# Altium schematic sheet driver.SchDoc
size A4; SheetNumber: 3; SheetTotal: 3; SPICEModelCacheZVOPVZIA: <root> / <DocumentId>ZVOPVZIA</DocumentId> / <CacheFrame Number="0"> / <Model Name="nmos" Kind="MDL"> / <Text>*Default N-Channel MOSFET / *Pinout: D,G,S / .MODEL NMOS NMOS()</Text> / </Model> / <Model Name="2n3904" Kind="MDL"> / <Text>*2N3904 / *Si 310mW  40V 200mA 300MHz pkg:TO-92B 1,2,3 / .MODEL 2N3904 NPN(IS=1.4E-14 BF=300 VAF=100 IKF=0.025 ISE=3E-13 / + BR=7.5 RC=2.4 CJE=4.5E-12 TF=4E-10 CJC=3.5E-12 TR=2.1E-8 XTB=1.5 KF=9E-16 )</Text> / </Model> / <Model Name="cap" Kind="MDL"> / <Text>*Default semiconductor capacitor / .MODEL CAP C()</Text> / </Model> / </CacheFrame> / </root>
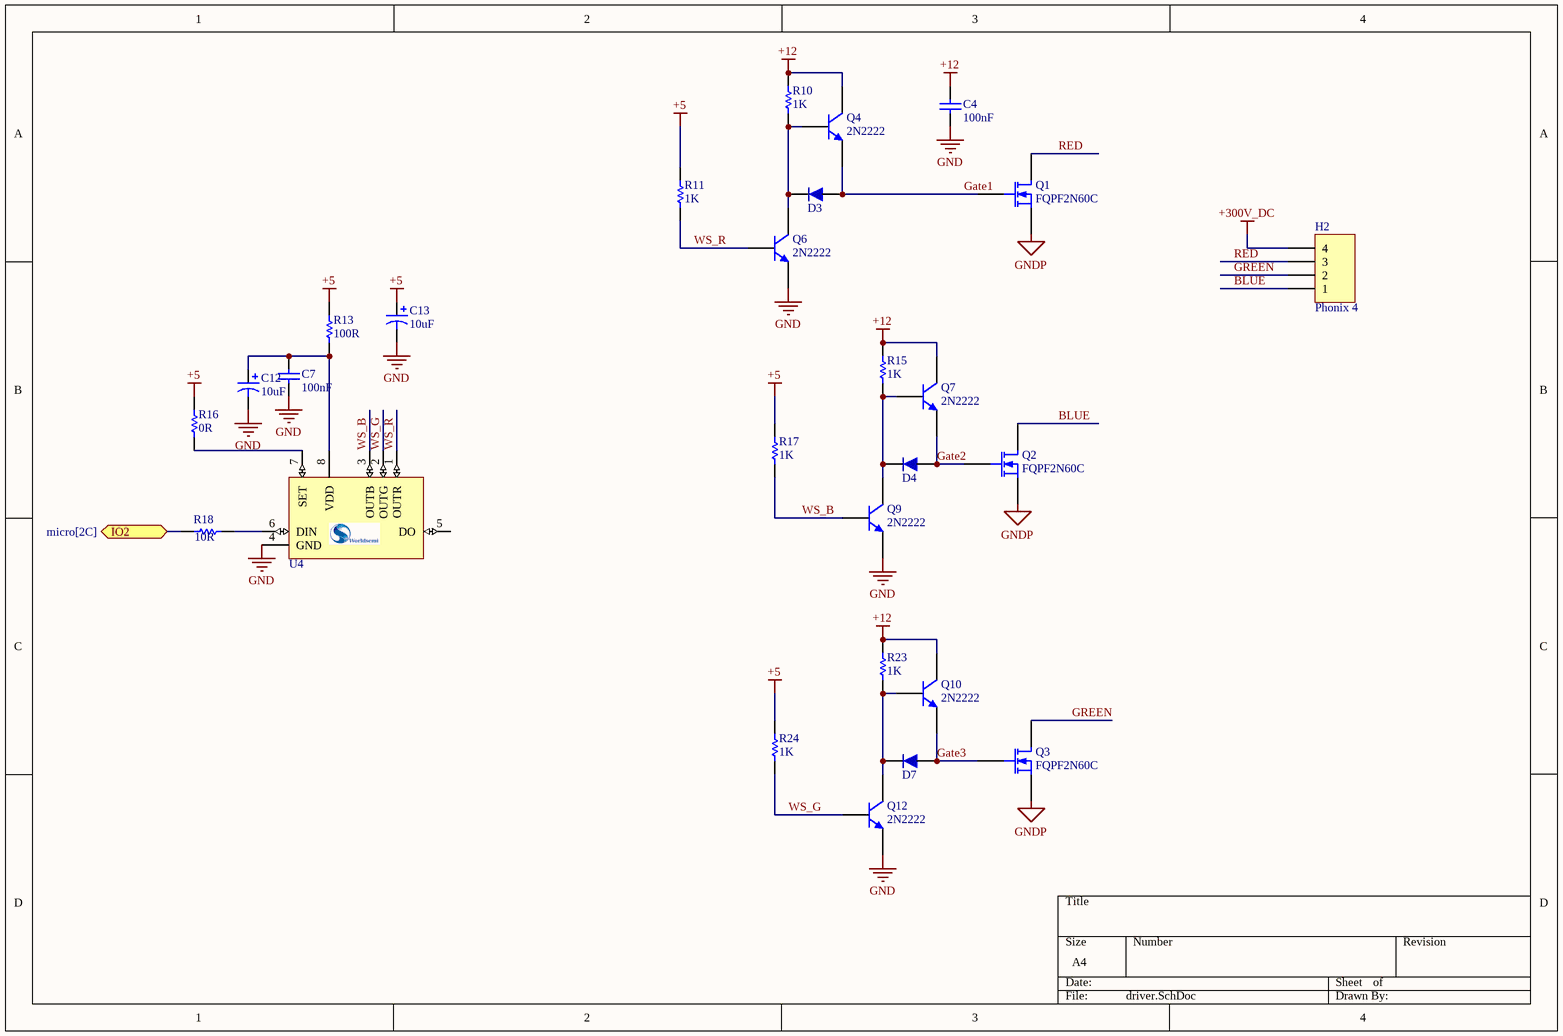
[diagram p0: driver.SchDoc]

## Parts
C4  value 100nF  [CAP0805]  (hidden comment: cap 100nF)
C7  value 100nF  [CAP0805]  (hidden comment: cap 100nF)
C12  value 10uF  [CAP0805]  (hidden comment: cap 10uF)
C13  value 10uF  [CAP0805]  (hidden comment: cap 10uF)
D3  1n5822  [DIOM4629X24N]  (value not drawn)
D4  1n5822  [DIOM4629X24N]  (value not drawn)
D7  1n5822  [DIOM4629X24N]  (value not drawn)
H2  Phonix 4  [phoenix terminal R 4]
Q1  FQPF2N60C  [TO-220]
Q2  FQPF2N60C  [TO-220]
Q3  FQPF2N60C  [TO-220]
Q4  2N2222  [SOT23_BEC_L]
Q6  2N2222  [SOT23_BEC_L]
Q7  2N2222  [SOT23_BEC_L]
Q9  2N2222  [SOT23_BEC_L]
Q10  2N2222  [SOT23_BEC_L]
Q12  2N2222  [SOT23_BEC_L]
R10  value 1K  [RES0805]  (hidden comment: Res 1K)
R11  value 1K  [RES0805]  (hidden comment: Res 1K)
R13  value 100R  [RES0805]  (hidden comment: Res 100R)
R15  value 1K  [RES0805]  (hidden comment: Res 1K)
R16  value 0R  [RES0805]  (hidden comment: Res 0R)
R17  value 1K  [RES0805]  (hidden comment: Res 1K)
R18  value 10R  [RES0805]  (hidden comment: Res 10R)
R23  value 1K  [RES0805]  (hidden comment: Res 1K)
R24  value 1K  [RES0805]  (hidden comment: Res 1K)
U4  WS2811 SMD  [8S2_N]  (value not drawn)

## Ports
IO2 (bidir, see micro[2C])

## Nets
+5: C13.1 R11.1 R13.2 R16.2 R17.1 R24.1
+12: C4.1 Q4.3(C) Q7.3(C) Q10.3(C) R10.2 R15.2 R23.2
+300V_DC: H2.4
GND: C4.2 C7.2 C12.2 C13.2 Q6.1(E) Q9.1(E) Q12.1(E) U4.4(GND)
GNDP: Q1.3(S) Q2.3(S) Q3.3(S)
BLUE: H2.1 Q2.1(D)
Gate1: D3.1 Q1.2(G) Q4.1(E)
Gate2: D4.1 Q2.2(G) Q7.1(E)
Gate3: D7.1 Q3.2(G) Q10.1(E)
GREEN: H2.2 Q3.1(D)
IO2: R18.1 ; port IO2
RED: H2.3 Q1.1(D)
WS_B: Q9.2(B) R17.2 U4.3(OUTB)
WS_G: Q12.2(B) R24.2 U4.2(OUTG)
WS_R: Q6.2(B) R11.2 U4.1(OUTR)
NetC7_1: C7.1 C12.1 R13.1 U4.8(VDD)
NetD3_2: D3.2 Q4.2(B) Q6.3(C) R10.1
NetD4_2: D4.2 Q7.2(B) Q9.3(C) R15.1
NetD7_2: D7.2 Q10.2(B) Q12.3(C) R23.1
NetR16_1: R16.1 U4.7(SET)
NetR18_2: R18.2 U4.6(DIN)

Not connected (* = marked no-connect by the designer): U4 5(DO)

## Library data of the parts
C4 C7 = Cap ceramic: CAP seramic
C12 C13 = Cap Pol1: CAP seramic; Published: 8-Jun-2000; LatestRevisionDate: 17-Jul-2002; LatestRevisionNote: Re-released for DXP Platform.; PackageReference: RB7.6-15; Publisher: Altium Limited; PackageDescription: Polarized Capacitor (Radial); 2 Leads
D3 D4 D7 = 1n4007 SMD M7: Schotcky diode; Part. No: M7; Manufacturer: DC COMPONENTS; Designer: Abbas Basereh; Link: http://www.tme.eu/en/details/m7/smd-universal-diodes/dc-components/; Link: https://www.aliexpress.com/item/Smd-tube-1n4007-m7-SMA/1213719741.html?spm=2114.01010208.3.1.ZyZ7bC&ws_ab_test=searchweb0_0,searchweb201602_4_10065_10068_10084_10083_10080_10082_10081_10060_10061_10062_10056_10055_10054_10059_10099_10078_10079_427_10073_10103_10102_10096_10052_10050_10051,searchweb201603_4&btsid=db2be5ca-e560-400a-b91c-484ab5ee228b; Data: 16-12-2016
H2 = Header 4: Header, 4-Pin; LatestRevisionDate: 17-Jul-2002; LatestRevisionNote: Re-released for DXP Platform.; Publisher: Altium Limited
Q1-Q3 = MOSFET-N: N-Channel MOSFET; pin to pad: 1>2 2>1; Published: 8-Jun-2000; LatestRevisionDate: 17-Jul-2002; LatestRevisionNote: Re-released for DXP Platform.; PackageVersion: 1995/1996; PackageReference: E3; Publisher: Altium Limited; PackageDescription: TO, Flat Index; 3 In-Line, Axial Leads; Body Dia. 4.6mm; Lead Dia. 0.5 mm (max)
Q4 Q6 Q7 Q9 Q10 Q12 = 2N3904: NPN General Purpose Amplifier; pin to pad: 1>2 2>1; Published: 8-Jun-2000; LatestRevisionDate: 15-Jan-2003; LatestRevisionNote: PCB Footprint 'BCY-W3/D4.7' replaced; DatasheetVersion: 1997; PackageVersion: Sep-1998; PackageReference: TO-92A; Publisher: Altium Limited; PackageDescription: TO, Flat Index; 3 In-Line, Axial Leads; Body Dia. 4.5mm; Leads 0.51 x 0.48 mm (max); ComponentLink1Description: Manufacturer Link; ComponentLink1URL: http://www.fairchildsemi.com/; ComponentLink2Description: Datasheet; ComponentLink2URL: http://www.fairchildsemi.com/ds/2N%2F2N3904.pdf
R10 R11 R13 R15-R18 R23 R24 = Res1: Resistor; Published: 8-Jun-2000; LatestRevisionDate: 17-Jul-2002; LatestRevisionNote: Re-released for DXP Platform.; PackageReference: AXIAL-0.3; Publisher: Altium Limited; PackageDescription: Axial Device, Thru-Hole; 2 Leads; 0.3 in Pin Spacing
U4 = WS2811 SMD: LED Driver IC 3 Output Linear 18.5mA Module 10PK; ComponentAvailability: Not recommended for new design.; Published: 2017-1-30; DatasheetVersion: 30-1-2017; PackageVersion: 30-1-2017; PackageReference: 8S2; Publisher: Abbas Basereh; PackageDescription: SOP-8; Supplier 1: Digi-Key; Supplier Part Number 1: WS2811; Supplier 2: Farnell; Supplier Part Number 2: 1378; Supplier 3: Mouser; Supplier Part Number 3: 1528-1537-ND; ComponentLink1Description: LED Driver IC 3 Output Linear 18.5mA Module 10PK; ComponentLink1URL: http://www.world-semi.com; ComponentLink2Description: WS2811; ComponentLink3Description: WS2811; ComponentLink4Description: http://www.world-semi.com